# Altium schematic sheet 2211B_SysArrosageAuto_MCU.SchDoc: Systeme d'arrosage auto
size 276 x 198 mm; CompanyName: ETML-ES; DrawnBy: Gatcia Luis; Organization: ETML-ES; SheetNumber: 2; SheetTotal: 2; SPICEModelCacheOIVPMRBS: <root> / <DocumentId>OIVPMRBS</DocumentId> / </root>
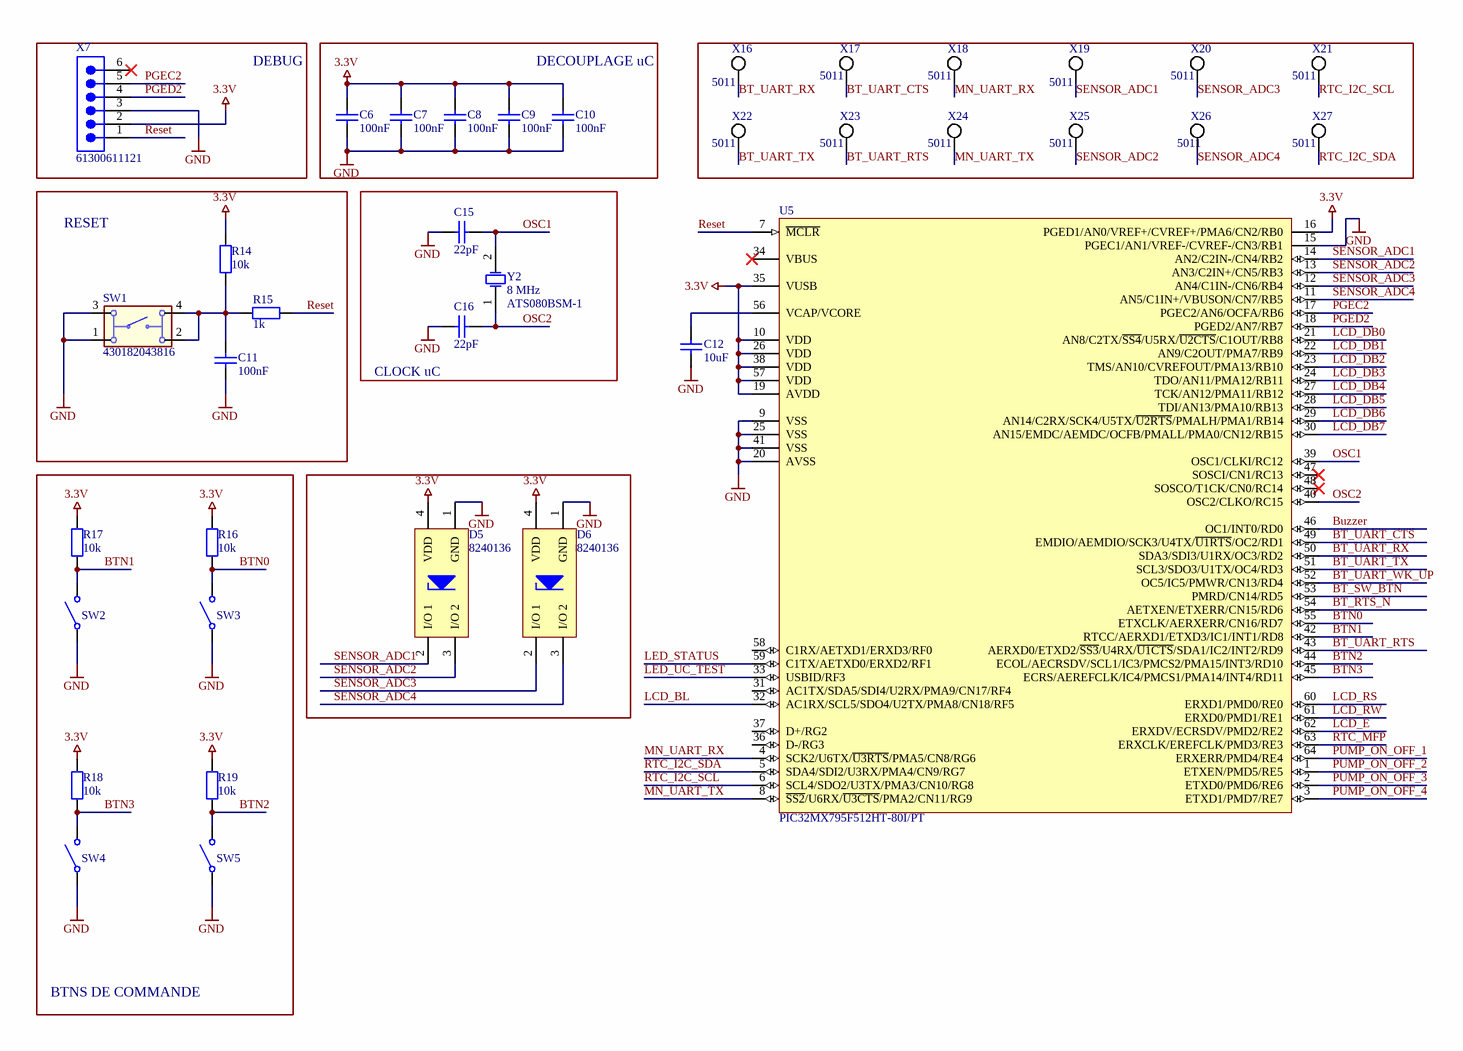
[diagram p0: 2211B_SysArrosageAuto_MCU.SchDoc, right]

## Parts
C6  100nF  [CAPC2013X145X48NL20T23]
C7  100nF  [CAPC2013X145X48NL20T23]
C8  100nF  [CAPC2013X145X48NL20T23]
C9  100nF  [CAPC2013X145X48NL20T23]
C10  100nF  [CAPC2013X145X48NL20T23]
C11  100nF  [CAPC2013X145X48NL20T23]
C12  10uF  [CAPC2013X145X48NL20T23]
C15  22pF  [CAPC2013X145X48NL20T23]
C16  22pF  [CAPC2013X145X48NL20T23]
D5  8240136  [WE-TVS_SOT143-4L]
D6  8240136  [WE-TVS_SOT143-4L]
R14  10k  [RESC2012X60N]
R15  1k  [RESC2012X60N]
R16  10k  [RESC2012X60N]
R17  10k  [RESC2012X60N]
R18  10k  [RESC2012X60N]
R19  10k  [RESC2012X60N]
SW1  430182043816  [SOIC_82043816_WRE-L]
SW2  Single-Pole,Single-Throw Switch  [61300211121]  (value not drawn)
SW3  Single-Pole,Single-Throw Switch  [61300211121]  (value not drawn)
SW4  Single-Pole,Single-Throw Switch  [61300211121]  (value not drawn)
SW5  Single-Pole,Single-Throw Switch  [61300211121]  (value not drawn)
U5  PIC32MX795F512HT-80I/PT  [TQFP-PT64_L]
X7  61300611121  [61300611121]
X16  5011  [Keystone_5011]
X17  5011  [Keystone_5011]
X18  5011  [Keystone_5011]
X19  5011  [Keystone_5011]
X20  5011  [Keystone_5011]
X21  5011  [Keystone_5011]
X22  5011  [Keystone_5011]
X23  5011  [Keystone_5011]
X24  5011  [Keystone_5011]
X25  5011  [Keystone_5011]
X26  5011  [Keystone_5011]
X27  5011  [Keystone_5011]
Y2  8 MHz  [ATS080BSM-1]

## Blocks framed on the sheet
DEBUG: X7
DECOUPLAGE uC: C6-C10
RESET: C11 R14 R15 SW1
CLOCK uC: C15 C16 Y2
BTNS DE COMMANDE: R16-R19 SW2-SW5

## Nets
3.3V: C6.2 C7.2 C8.2 C9.2 C10.2 D5.4(VDD) D6.4(VDD) R14.2 R16.2 R17.2 R18.2 R19.2 U5.10(VDD) U5.16(PGED1/AN0/VREF+/CVREF+/PMA6/CN2/RB0) U5.19(AVDD) U5.26(VDD) U5.35(VUSB) U5.38(VDD) U5.57(VDD) X7.2
GND: C6.1 C7.1 C8.1 C9.1 C10.1 C11.1 C12.1 C15.1 C16.1 D5.1(GND) D6.1(GND) SW1.1 SW1.3 SW2.1 SW3.1 SW4.1 SW5.1 U5.9(VSS) U5.15(PGEC1/AN1/VREF-/CVREF-/CN3/RB1) U5.20(AVSS) U5.25(VSS) U5.41(VSS) X7.3
BT_RTS_N: U5.54(AETXEN/ETXERR/CN15/RD6)
BT_SW_BTN: U5.53(PMRD/CN14/RD5)
BT_UART_CTS: U5.49(EMDIO/AEMDIO/SCK3/U4TX/~{U1RTS}/OC2/RD1) X17.1(TP)
BT_UART_RTS: U5.43(AERXD0/ETXD2/~{SS3}/U4RX/~{U1CTS}/SDA1/IC2/INT2/RD9) X23.1(TP)
BT_UART_RX: U5.50(SDA3/SDI3/U1RX/OC3/RD2) X16.1(TP)
BT_UART_TX: U5.51(SCL3/SDO3/U1TX/OC4/RD3) X22.1(TP)
BT_UART_WK_UP: U5.52(OC5/IC5/PMWR/CN13/RD4)
BTN0: R16.1 SW3.2 U5.55(ETXCLK/AERXERR/CN16/RD7)
BTN1: R17.1 SW2.2 U5.42(RTCC/AERXD1/ETXD3/IC1/INT1/RD8)
BTN2: R19.1 SW5.2 U5.44(ECOL/AECRSDV/SCL1/IC3/PMCS2/PMA15/INT3/RD10)
BTN3: R18.1 SW4.2 U5.45(ECRS/AEREFCLK/IC4/PMCS1/PMA14/INT4/RD11)
Buzzer: U5.46(OC1/INT0/RD0)
LCD_BL: U5.32(AC1RX/SCL5/SDO4/U2TX/PMA8/CN18/RF5)
LCD_DB0: U5.21(AN8/C2TX/~{SS4}/U5RX/~{U2CTS}/C1OUT/RB8)
LCD_DB1: U5.22(AN9/C2OUT/PMA7/RB9)
LCD_DB2: U5.23(TMS/AN10/CVREFOUT/PMA13/RB10)
LCD_DB3: U5.24(TDO/AN11/PMA12/RB11)
LCD_DB4: U5.27(TCK/AN12/PMA11/RB12)
LCD_DB5: U5.28(TDI/AN13/PMA10/RB13)
LCD_DB6: U5.29(AN14/C2RX/SCK4/U5TX/~{U2RTS}/PMALH/PMA1/RB14)
LCD_DB7: U5.30(AN15/EMDC/AEMDC/OCFB/PMALL/PMA0/CN12/RB15)
LCD_E: U5.62(ERXDV/ECRSDV/PMD2/RE2)
LCD_RS: U5.60(ERXD1/PMD0/RE0)
LCD_RW: U5.61(ERXD0/PMD1/RE1)
LED_STATUS: U5.59(C1TX/AETXD0/ERXD2/RF1)
LED_UC_TEST: U5.33(USBID/RF3)
MN_UART_RX: U5.4(SCK2/U6TX/~{U3RTS}/PMA5/CN8/RG6) X18.1(TP)
MN_UART_TX: U5.8(~{SS2}/U6RX/~{U3CTS}/PMA2/CN11/RG9) X24.1(TP)
OSC1: C15.2 U5.39(OSC1/CLKI/RC12) Y2.2(OSC2)
OSC2: C16.2 U5.40(OSC2/CLKO/RC15) Y2.1(OSC1)
PGEC2: U5.17(PGEC2/AN6/OCFA/RB6) X7.5
PGED2: U5.18(PGED2/AN7/RB7) X7.4
PUMP_ON_OFF_1: U5.64(ERXERR/PMD4/RE4)
PUMP_ON_OFF_2: U5.1(ETXEN/PMD5/RE5)
PUMP_ON_OFF_3: U5.2(ETXD0/PMD6/RE6)
PUMP_ON_OFF_4: U5.3(ETXD1/PMD7/RE7)
Reset: R15.2 U5.7(~{MCLR}) X7.1
RTC_I2C_SCL: U5.6(SCL4/SDO2/U3TX/PMA3/CN10/RG8) X21.1(TP)
RTC_I2C_SDA: U5.5(SDA4/SDI2/U3RX/PMA4/CN9/RG7) X27.1(TP)
RTC_MFP: U5.63(ERXCLK/EREFCLK/PMD3/RE3)
SENSOR_ADC1: D5.2(I/O_1) U5.14(AN2/C2IN-/CN4/RB2) X19.1(TP)
SENSOR_ADC2: D5.3(I/O_2) U5.13(AN3/C2IN+/CN5/RB3) X25.1(TP)
SENSOR_ADC3: D6.2(I/O_1) U5.12(AN4/C1IN-/CN6/RB4) X20.1(TP)
SENSOR_ADC4: D6.3(I/O_2) U5.11(AN5/C1IN+/VBUSON/CN7/RB5) X26.1(TP)
NetC11_2: C11.2 R14.1 R15.1 SW1.2 SW1.4
NetC12_2: C12.2 U5.56(VCAP/VCORE)

Not connected (* = marked no-connect by the designer): U5 31(AC1TX/SDA5/SDI4/U2RX/PMA9/CN17/RF4) 34(VBUS)* 36(D-/RG3) 37(D+/RG2) 47(SOSCI/CN1/RC13)* 48(SOSCO/T1CK/CN0/RC14)* 58(C1RX/AETXD1/ERXD3/RF0); X7 6*

## Notes on the sheet
- a
- Dessiné
- A4
- Echelle :
- Mod.
- b
- c
- d
- Contrôlé
- Remplace
- Nb. feuilles
- Feuille n°
- Nom du projet
- No

## Library data of the parts
C6-C12 C15 C16 = Capacitor_Non-Polarized
  C6-C11: Capacité: 100nF
  C12: Capacité: 10uF
  C15 C16: Capacité: 22pF
D5 D6 = CMP-1486-00002-2: NexarPartId: 18190099; Max Breakdown Voltage: 4.5V; Number of Channels: 2; Max Reverse Leakage Current: 5A; Element Configuration: Dual; Capacitance: 3pF; Working Voltage: 3.3V; Max Surge Current: 12A; Power Line Protection: Yes; Clamping Voltage: 6V; Leakage Current: 5µA; Test Current: 1mA; Polarity: Bidirectional; Direction: Unidirectional; Operating Supply Voltage: 3.8V; Breakdown Voltage: 4.5V; Mount: Surface Mount; Height: 1.06mm; Min Operating Temperature: -55°C; Termination: SMD/SMT; Reverse Standoff Voltage: 3.3V; Case/Package: SOT-143; Length: 2.92mm; Min Breakdown Voltage: 4.5V; Peak Pulse Current: 12A; Max Operating Temperature: 125°C; REACH SVHC: Unknown; ESD Protection: Yes; RoHS: Compliant; Number of Pins: 4; Width: 2.4mm; Packaging: Digi-Reel®; Number of Bidirectional Channels: 2
R14-R19 = R-SMD: SMD Chip Resistor, 10 kOhm, ± 1%, 125 mW, 0805 [2012 Metric], Thick Film, General Purpose; Manufacturer: Yageo; Manufacturer Part Number: RC0805FR-0710KL; Temperature Coefficient: 100ppm/°C; Power Rating: 125mW; Voltage Rating: 150V; Supplier: Rs; Supplier Part Number: 6185163; RoHS: Yes; Category: Chip SMD Resistors; Stock: 360000; Pricing: 1=24.917 (CHF); Case/Package: 0805; Case Code (Imperial): 0805; Case Code (Metric): 2012; Min Operating Temperature: -55°C; Max Operating Temperature: 155°C; Packaging: Tape and Reel; Tolerance: 1%; Resistor Type: Thick Film; Package Quantity: 1; Termination: SMD/SMT; Number of Terminations: 2; Max Power Dissipation: 125mW; Features: Moisture Resistant; Series: RC; Construction: Rectangular; Resistance Tolerance: 1%; Technology: THICK FILM; Voltage Rating (AC): 150V; Length: 0.079inch; Width: 0.049inch; Height: 0.024inch; Depth: 1.25mm; Lead Free: Lead Free; Reach SVHC Compliant: Unknown; Military Standard: Not; RoHS Compliant: Yes; ComponentLink1URL: https://datasheet.ciiva.com/11808/0900766b8106beab-11808151.pdf?src-supplier=Rs; ComponentLink1Description: https://datasheet.ciiva.com/11808/0900766b8106beab-11808151.pdf?src-supplier=Rs; ComponentLink2URL: https://datasheet.ciiva.com/46447/444164-46447563.pdf?src-supplier=Element14; ComponentLink2Description: https://datasheet.ciiva.com/46447/444164-46447563.pdf?src-supplier=Element14; ComponentLink3URL: https://datasheet.ciiva.com/2456/pyu-r-int-thick-7-2456973.pdf?src-supplier=Digikey; ComponentLink3Description: https://datasheet.ciiva.com/2456/pyu-r-int-thick-7-2456973.pdf?src-supplier=Digikey; ComponentLink4URL: https://datasheet.ciiva.com/2456/pyu-r-int-thick-7-2456974.pdf?src-supplier=Digikey; ComponentLink4Description: https://datasheet.ciiva.com/2456/pyu-r-int-thick-7-2456974.pdf?src-supplier=Digikey; ComponentLink5URL: https://datasheet.ciiva.com/2456/pyu-r-int-thick-7-2456972.pdf?src-supplier=Digikey; ComponentLink5Description: https://datasheet.ciiva.com/2456/pyu-r-int-thick-7-2456972.pdf?src-supplier=Digikey; ComponentLink6URL: https://datasheet.ciiva.com/12669/rc0805-12669688.pdf?src-supplier=Mouser; ComponentLink6Description: https://datasheet.ciiva.com/12669/rc0805-12669688.pdf?src-supplier=Mouser
  R14 R16-R19: Value: 10k
  R15: Value: 1k
SW1 = SWITCH_SPST-NO: Switch Tactile N.O. SPST Round Button Gull Wing 0.05A 12VDC 1000000Cycles 1.57N SMD Reel; Manufacturer: Wurth Electronics; Voltage Rating: 12V; Supplier: Rs; Supplier Part Number: 7856260; Manufacturer Part Number: 430182043816; RoHS: Yes; Category: Tactile Switches; Stock: 91; Pricing: 1=0.536, 10=0.483, 25=0.441, 50=0.399, 100=0.378 (CHF); Color: 46Colour; Contact Plating: 159ConductorMaterial; Diameter: 3.5mm; ComponentLink1URL: https://datasheet.ciiva.com/30466/0900766b8126d19d-30466797.pdf?src-supplier=Rs; ComponentLink1Description: https://datasheet.ciiva.com/30466/0900766b8126d19d-30466797.pdf?src-supplier=Rs; ComponentLink2URL: https://datasheet.ciiva.com/29189/711706-da-01-en-taster-430182043816-29189278.pdf?src-supplier=Conrad; ComponentLink2Description: https://datasheet.ciiva.com/29189/711706-da-01-en-taster-430182043816-29189278.pdf?src-supplier=Conrad; ComponentLink3URL: https://datasheet.ciiva.com/1532/4301x2-1532481.pdf?src-supplier=Element14; ComponentLink3Description: https://datasheet.ciiva.com/1532/4301x2-1532481.pdf?src-supplier=Element14
SW2-SW5 = SPST SW: closed: 0; Rclosed: 1m; Ropen: 1Meg; SimulationGenericComponent: True
U5 = CMP-0048-00048-2: High Performance 80 MHz MIPS-Based 32-Bit Flash Microcontroller with USB, CAN and Ethernet, 512KB Program Memory, 64-pin TQFP, Industrial Temperature, Tape and Reel; Code_JEDEC: MS-026; DatasheetVersion: revG, May-2011; ComponentLink1Description: Datasheet; PackageReference: TQFP-PT64; PackageVersion: revBB, Aug-2009; ComponentLink1URL: http://ww1.microchip.com/downloads/en/DeviceDoc/61156G.pdf; ComponentLink2URL: http://ww1.microchip.com/downloads/en/PackagingSpec/en012702.pdf; ComponentLink3Description: Microchip.com Home; RevisionNote: Component URLs added. DatasheetVersion updated. Pin names updated.; ComponentLink2Description: Packaging Specification; PackageDescription: 64-Lead Thin Plastic Quad Flat Pack (PT) - 10x10x1mm Body, 2.00mm [TQFP]; ComponentLink3URL: http://www.microchip.com/
X7 = CMP-1502-01068-2_1: THT Vertical Pin Header WR-PHD, Pitch 2.54 mm, Single Row, 6 pins; NexarPartId: 32855526; Manufacturer: Wurth Electronics; Operating Supply Voltage: 250V; Number of Contacts: 5; Connector Type: Male Pin; Current Rating: 3A; Contact Resistance: 20mΩ; Pitch: 2.54mm; Gender: Male; Termination: Solder; RoHS: Compliant; Lead Pitch: 2.54mm; Contact Mating Length: 5.9944mm; Number of Positions: 5; Lead Free: Lead Free; Contact Plating: Gold; Number of Pins: 5; Min Operating Temperature: -40°C; Voltage Rating: 250V; Color: Black; Mount: Through Hole; REACH SVHC: Unknown; Packaging: Bulk; Height: 8.89mm; Number of Rows: 1; Orientation: Vertical; Contact Material: Copper; Max Operating Temperature: 105°C; Supplier 1: Rs; Manufacturer Part Number: 61300611121; Category: Headers and Wire Housings; Stock 1: 2555; Pricing 1: 125=0,153, 500=0,149, 2500=0,147, 5000=0,141 (CHF); Housing Material: PBT; Contact Gender: Male; Series: WR-PHD; Contact Type: Male Pin; RoHS Compliant: Yes; Reach SVHC Compliant: Unknown; ComponentLink1URL: http://www.mouser.com/ds/2/445/6130xx11121-538006.pdf?src-supplier=Mouser; ComponentLink1Description: http://www.mouser.com/ds/2/445/6130xx11121-538006.pdf?src-supplier=Mouser; ComponentLink2URL: http://www.farnell.com/cad/1737268.pdf?src-supplier=Element14; ComponentLink2Description: http://www.farnell.com/cad/1737268.pdf?src-supplier=Element14; ComponentLink3URL: https://datasheet.octopart.com/61300611121-W%C3%BCrth-Elektronik-datasheet-21154836.pdf?src-supplier=Element14; ComponentLink3Description: https://datasheet.octopart.com/61300611121-W%C3%BCrth-Elektronik-datasheet-21154836.pdf?src-supplier=Element14; ComponentLink4URL: https://katalog.we-online.de/em/datasheet/6130xx11121.pdf?src-supplier=Digikey; ComponentLink4Description: https://katalog.we-online.de/em/datasheet/6130xx11121.pdf?src-supplier=Digikey
X16-X27 = TEST_POINT_THT: TEST POINT, PCB, THROUGH HOLE; Product R; Range: -; Connector Colour: Black; Mounting: Through Hole; Manufacturer: Keystone; Manufacturer: Keystone Electronics; IsStocked: True; PN: PN-926990; Supplier 1: ETML; Value: 5011; Manufacturer Number: 5011; Supplier Part Number 1: MAG.428.014; Category: Connectors; SubCategory: Testpoints; Supplier Price 1: 0.2439; Manufacturer Part Number: 5011; Component Type: Connectors; Supplier: Rs; Supplier Part Number: 2042652; RoHS: Yes; Stock: 1300; Pricing: 100=0.37, 500=0.359, 1000=0.35, 4000=0.34 (CHF); ComponentLink1URL: https://datasheet.ciiva.com/11744/0900766b8009b7c7-11744935.pdf?src-supplier=Rs; ComponentLink1Description: https://datasheet.ciiva.com/11744/0900766b8009b7c7-11744935.pdf?src-supplier=Rs; ComponentLink2URL: https://datasheet.ciiva.com/1454/1718230-1454834.pdf?src-supplier=Element14; ComponentLink2Description: https://datasheet.ciiva.com/1454/1718230-1454834.pdf?src-supplier=Element14; ComponentLink3URL: https://datasheet.ciiva.com/46412/1703983-46412138.pdf?src-supplier=Element14; ComponentLink3Description: https://datasheet.ciiva.com/46412/1703983-46412138.pdf?src-supplier=Element14; ComponentLink4URL: https://datasheet.ciiva.com/16351/m60-2p60-16351093.pdf?src-supplier=Future+Electronics; ComponentLink4Description: https://datasheet.ciiva.com/16351/m60-2p60-16351093.pdf?src-supplier=Future+Electronics; ComponentLink5URL: https://datasheet.ciiva.com/2917/5011-2917635.pdf?src-supplier=Digikey; ComponentLink5Description: https://datasheet.ciiva.com/2917/5011-2917635.pdf?src-supplier=Digikey
Y2 = XTAL: Crystal 8MHz ±30ppm (Tol) ±50ppm (Stability) 18pF FUND 60Ohm 2-Pin HC-49/US SM SMD T/R; Manufacturer: CTS; Published: 8-Jun-2000; LatestRevisionDate: 17-Jul-2002; LatestRevisionNote: Re-released for DXP Platform.; PackageReference: R38; Publisher: Altium Limited; PackageDescription: Crystal, Thru-Hole; 2 Leads; Body 3.1 x 8.2 mm (Dia.xH); Supplier 1: Avnet; Manufacturer Part Number: ATS080BSM-1; RoHS: Yes; Category: Crystals; Stock 1: 10000; Pricing 1: 1000=0,14104, 2500=0,1386, 5000=0,13616, 10000=0,13372, 20000=0,13128 (USD); ComponentLink1URL: https://datasheet.ciiva.com/16413/008-0309-0-16413903.pdf?src-supplier=Future+Electronics; ComponentLink1Description: https://datasheet.ciiva.com/16413/008-0309-0-16413903.pdf?src-supplier=Future+Electronics; ComponentLink2URL: https://datasheet.ciiva.com/26926/getdatasheetpartid-488404-26926661.pdf?src-supplier=Verical; ComponentLink2Description: https://datasheet.ciiva.com/26926/getdatasheetpartid-488404-26926661.pdf?src-supplier=Verical; ComponentLink3URL: https://datasheet.ciiva.com/3176/008-0309-0-3176343.pdf?src-supplier=Avnet; ComponentLink3Description: https://datasheet.ciiva.com/3176/008-0309-0-3176343.pdf?src-supplier=Avnet; ComponentLink4URL: https://datasheet.ciiva.com/852/008-0309-0-852310.pdf?src-supplier=Digikey; ComponentLink4Description: https://datasheet.ciiva.com/852/008-0309-0-852310.pdf?src-supplier=Digikey; ComponentLink5URL: https://datasheet.ciiva.com/852/008-0309-0-852311.pdf?src-supplier=Digikey; ComponentLink5Description: https://datasheet.ciiva.com/852/008-0309-0-852311.pdf?src-supplier=Digikey; ComponentLink6URL: https://datasheet.ciiva.com/852/008-0309-0-852312.pdf?src-supplier=Digikey; ComponentLink6Description: https://datasheet.ciiva.com/852/008-0309-0-852312.pdf?src-supplier=Digikey; Supplier Part Number 1: ATS080BSM-1